# Altium project NixieClockR2.PrjPCB
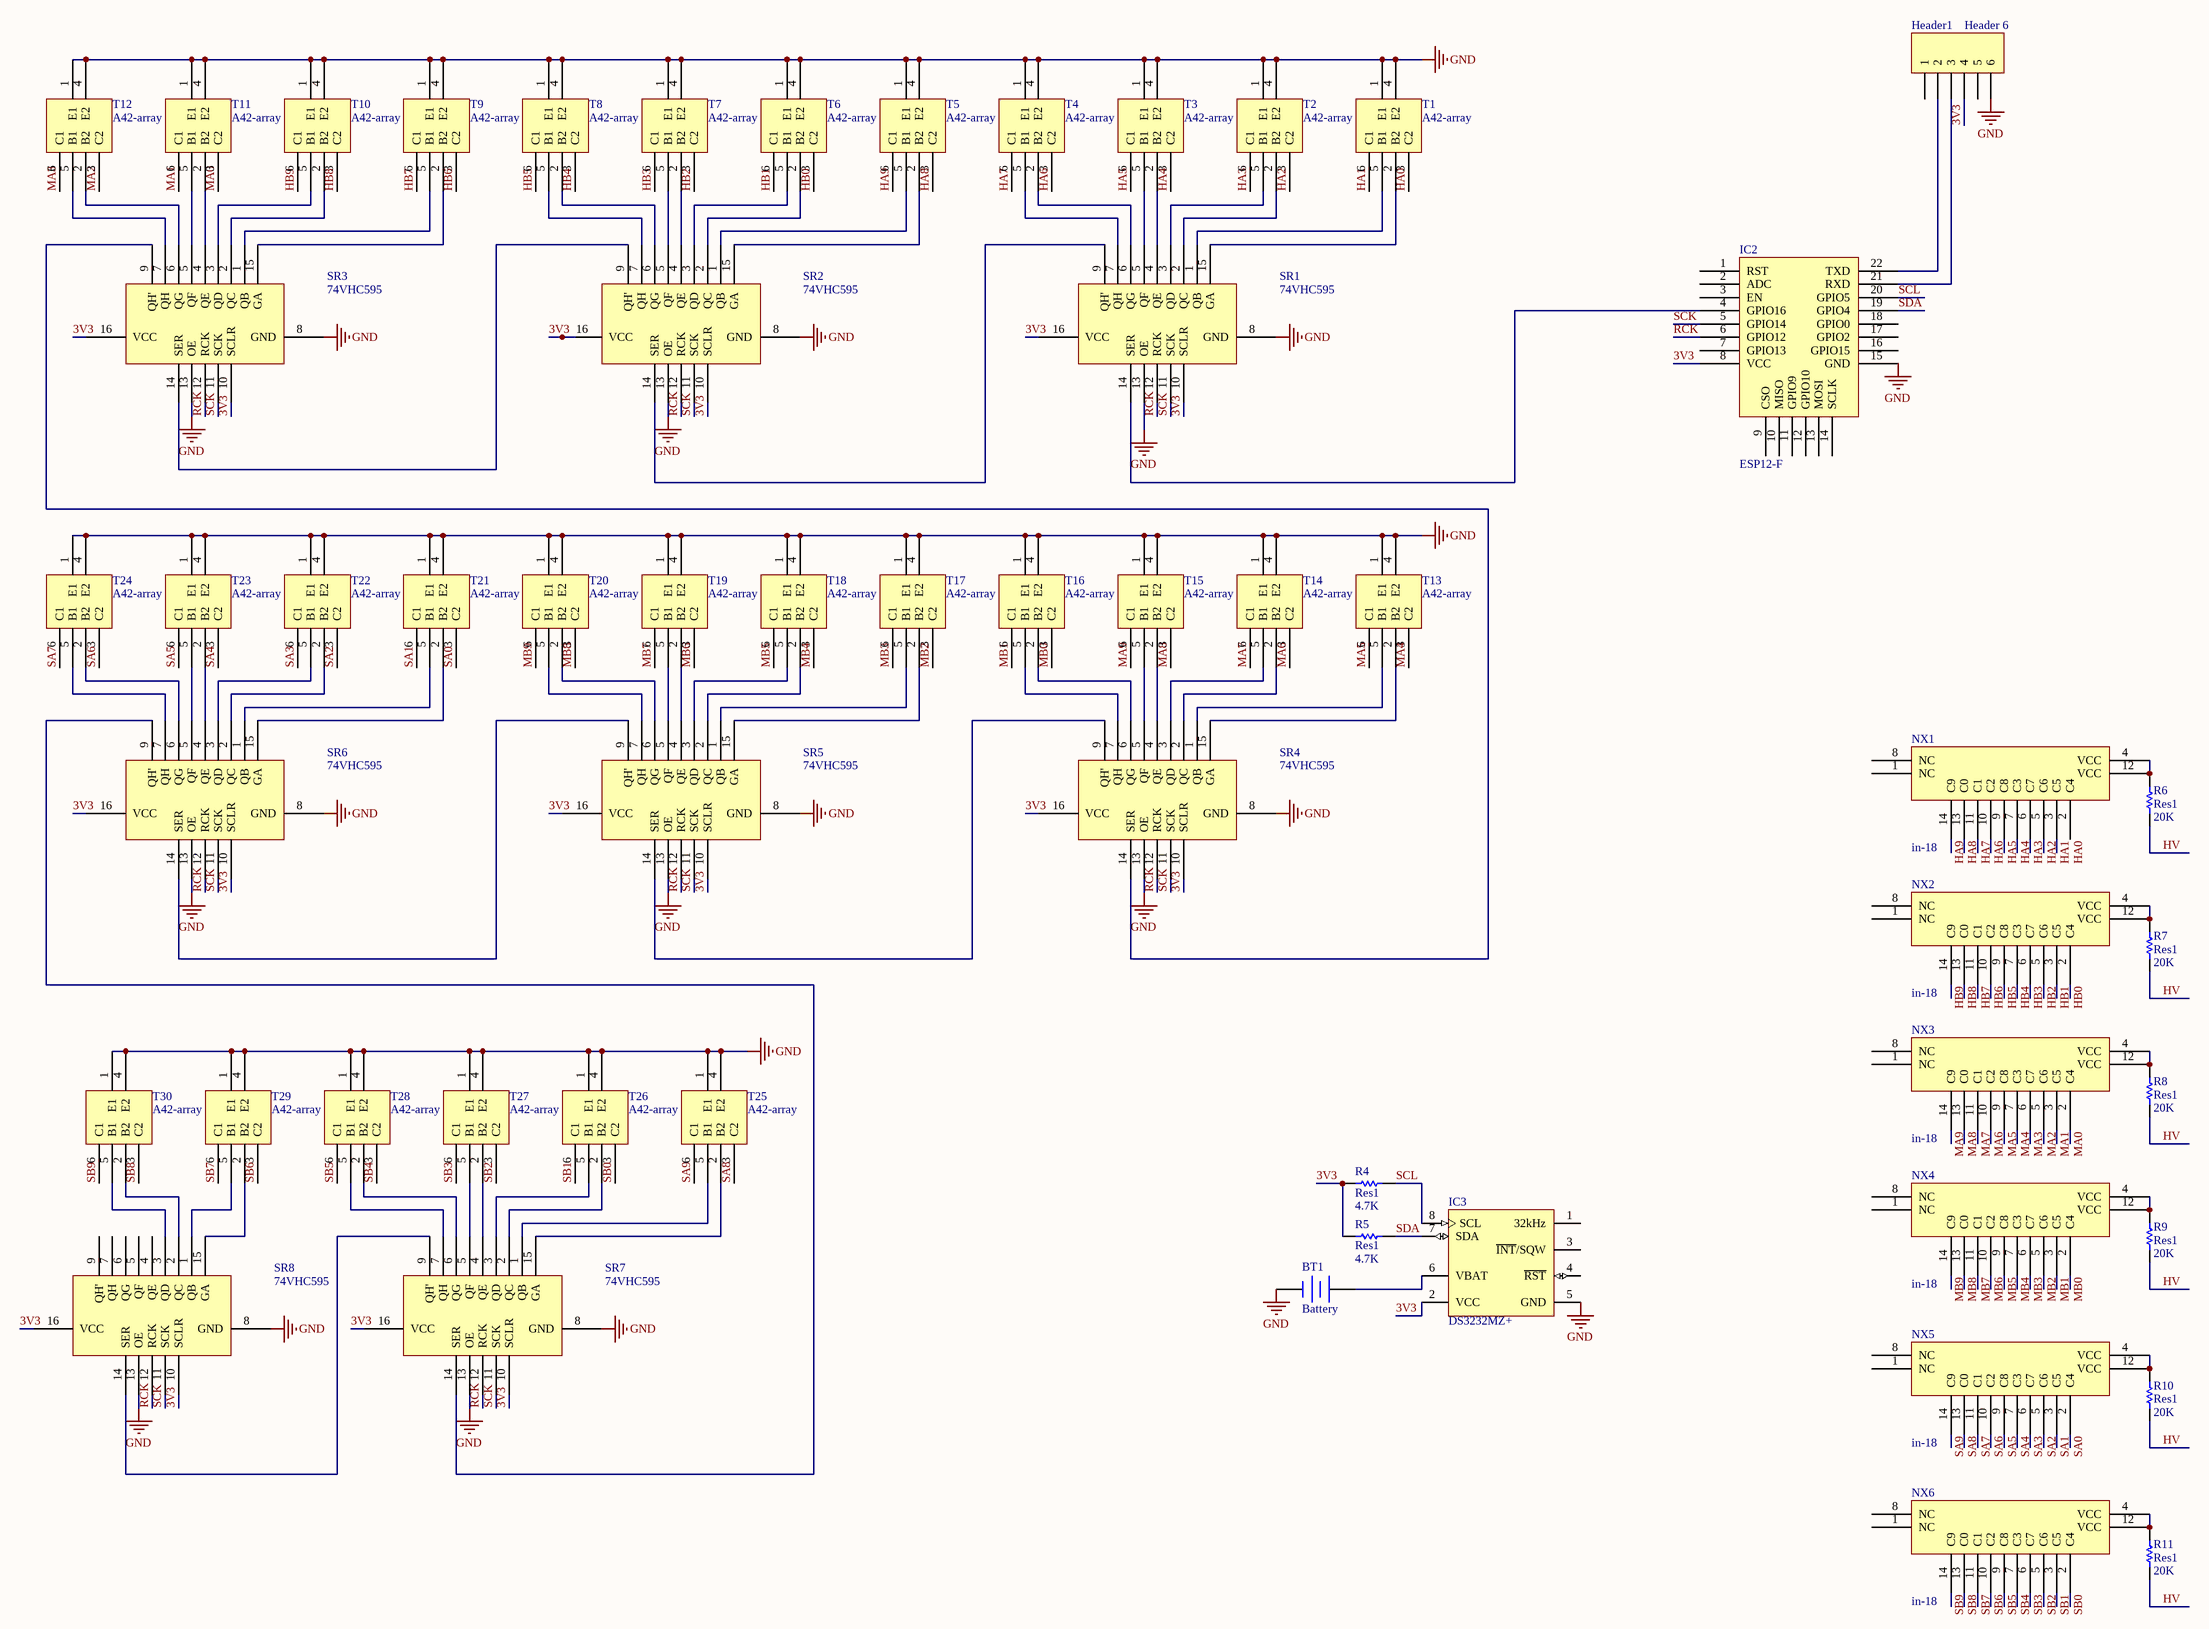
[diagram p0: Digits.SchDoc]
1 sheet, 56 parts. Net scope: global (net labels, ports and power ports of the same name join across sheets).
Board file: NixieClockR2.PcbDoc

## Sheet Digits.SchDoc
size C; Organization: Altium Limited; Address1: L3, 12a Rodborough Rd; Address2: Frenchs Forest; Address3: NSW; Address4: Australia 2086

### Parts
BT1  Battery  [cr1220]
Header1  Header 6  [HDR1X6]
IC2  ESP12-F  [ESP12-F]
IC3  DS3232MZ+  [DS3231]
NX1  in-18  [in-18]
NX2  in-18  [in-18]
NX3  in-18  [in-18]
NX4  in-18  [in-18]
NX5  in-18  [in-18]
NX6  in-18  [in-18]
R4  Res1  value 4.7K  [6-0805_M]
R5  Res1  value 4.7K  [6-0805_M]
R6  Res1  value 20K  [6-0805_M]
R7  Res1  value 20K  [6-0805_M]
R8  Res1  value 20K  [6-0805_M]
R9  Res1  value 20K  [6-0805_M]
R10  Res1  value 20K  [6-0805_M]
R11  Res1  value 20K  [6-0805_M]
SR1  74VHC595  [74VHC595]
SR2  74VHC595  [74VHC595]
SR3  74VHC595  [74VHC595]
SR4  74VHC595  [74VHC595]
SR5  74VHC595  [74VHC595]
SR6  74VHC595  [74VHC595]
SR7  74VHC595  [74VHC595]
SR8  74VHC595  [74VHC595]
T1  A42-array  [SOT457]
T2  A42-array  [SOT457]
T3  A42-array  [SOT457]
T4  A42-array  [SOT457]
T5  A42-array  [SOT457]
T6  A42-array  [SOT457]
T7  A42-array  [SOT457]
T8  A42-array  [SOT457]
T9  A42-array  [SOT457]
T10  A42-array  [SOT457]
T11  A42-array  [SOT457]
T12  A42-array  [SOT457]
T13  A42-array  [SOT457]
T14  A42-array  [SOT457]
T15  A42-array  [SOT457]
T16  A42-array  [SOT457]
T17  A42-array  [SOT457]
T18  A42-array  [SOT457]
T19  A42-array  [SOT457]
T20  A42-array  [SOT457]
T21  A42-array  [SOT457]
T22  A42-array  [SOT457]
T23  A42-array  [SOT457]
T24  A42-array  [SOT457]
T25  A42-array  [SOT457]
T26  A42-array  [SOT457]
T27  A42-array  [SOT457]
T28  A42-array  [SOT457]
T29  A42-array  [SOT457]
T30  A42-array  [SOT457]

### Nets
GND: BT1.2(-) Header1.6 IC2.15(GND) IC3.5(GND) SR1.8(GND) SR1.13(OE) SR2.8(GND) SR2.13(OE) SR3.8(GND) SR3.13(OE) SR4.8(GND) SR4.13(OE) SR5.8(GND) SR5.13(OE) SR6.8(GND) SR6.13(OE) SR7.8(GND) SR7.13(OE) SR8.8(GND) SR8.13(OE) T1.1(E1) T1.4(E2) T2.1(E1) T2.4(E2) T3.1(E1) T3.4(E2) T4.1(E1) T4.4(E2) T5.1(E1) T5.4(E2) T6.1(E1) T6.4(E2) T7.1(E1) T7.4(E2) T8.1(E1) T8.4(E2) T9.1(E1) T9.4(E2) T10.1(E1) T10.4(E2) T11.1(E1) T11.4(E2) T12.1(E1) T12.4(E2) T13.1(E1) T13.4(E2) T14.1(E1) T14.4(E2) T15.1(E1) T15.4(E2) T16.1(E1) T16.4(E2) T17.1(E1) T17.4(E2) T18.1(E1) T18.4(E2) T19.1(E1) T19.4(E2) T20.1(E1) T20.4(E2) T21.1(E1) T21.4(E2) T22.1(E1) T22.4(E2) T23.1(E1) T23.4(E2) T24.1(E1) T24.4(E2) T25.1(E1) T25.4(E2) T26.1(E1) T26.4(E2) T27.1(E1) T27.4(E2) T28.1(E1) T28.4(E2) T29.1(E1) T29.4(E2) T30.1(E1) T30.4(E2)
3V3: Header1.4 IC2.8(VCC) IC3.2(VCC) R4.2 R5.2 SR1.10(SCLR) SR1.16(VCC) SR2.10(SCLR) SR2.16(VCC) SR3.10(SCLR) SR3.16(VCC) SR4.10(SCLR) SR4.16(VCC) SR5.10(SCLR) SR5.16(VCC) SR6.10(SCLR) SR6.16(VCC) SR7.10(SCLR) SR7.16(VCC) SR8.10(SCLR) SR8.16(VCC)
HA0: NX1.2(C4) T1.3(C2)
HA1: NX1.3(C5) T1.6(C1)
HA2: NX1.5(C6) T2.3(C2)
HA3: NX1.6(C7) T2.6(C1)
HA4: NX1.7(C3) T3.3(C2)
HA5: NX1.9(C8) T3.6(C1)
HA6: NX1.10(C2) T4.3(C2)
HA7: NX1.11(C1) T4.6(C1)
HA8: NX1.13(C0) T5.3(C2)
HA9: NX1.14(C9) T5.6(C1)
HB0: NX2.2(C4) T6.3(C2)
HB1: NX2.3(C5) T6.6(C1)
HB2: NX2.5(C6) T7.3(C2)
HB3: NX2.6(C7) T7.6(C1)
HB4: NX2.7(C3) T8.3(C2)
HB5: NX2.9(C8) T8.6(C1)
HB6: NX2.10(C2) T9.3(C2)
HB7: NX2.11(C1) T9.6(C1)
HB8: NX2.13(C0) T10.3(C2)
HB9: NX2.14(C9) T10.6(C1)
HV: R6.1 R7.1 R8.1 R9.1 R10.1 R11.1
MA0: NX3.2(C4) T11.3(C2)
MA1: NX3.3(C5) T11.6(C1)
MA2: NX3.5(C6) T12.3(C2)
MA3: NX3.6(C7) T12.6(C1)
MA4: NX3.7(C3) T13.3(C2)
MA5: NX3.9(C8) T13.6(C1)
MA6: NX3.10(C2) T14.3(C2)
MA7: NX3.11(C1) T14.6(C1)
MA8: NX3.13(C0) T15.3(C2)
MA9: NX3.14(C9) T15.6(C1)
MB0: NX4.2(C4) T16.3(C2)
MB1: NX4.3(C5) T16.6(C1)
MB2: NX4.5(C6) T17.3(C2)
MB3: NX4.6(C7) T17.6(C1)
MB4: NX4.7(C3) T18.3(C2)
MB5: NX4.9(C8) T18.6(C1)
MB6: NX4.10(C2) T19.3(C2)
MB7: NX4.11(C1) T19.6(C1)
MB8: NX4.13(C0) T20.3(C2)
MB9: NX4.14(C9) T20.6(C1)
RCK: IC2.6(GPIO12) SR1.12(RCK) SR2.12(RCK) SR3.12(RCK) SR4.12(RCK) SR5.12(RCK) SR6.12(RCK) SR7.12(RCK) SR8.12(RCK)
SA0: NX5.2(C4) T21.3(C2)
SA1: NX5.3(C5) T21.6(C1)
SA2: NX5.5(C6) T22.3(C2)
SA3: NX5.6(C7) T22.6(C1)
SA4: NX5.7(C3) T23.3(C2)
SA5: NX5.9(C8) T23.6(C1)
SA6: NX5.10(C2) T24.3(C2)
SA7: NX5.11(C1) T24.6(C1)
SA8: NX5.13(C0) T25.3(C2)
SA9: NX5.14(C9) T25.6(C1)
SB0: NX6.2(C4) T26.3(C2)
SB1: NX6.3(C5) T26.6(C1)
SB2: NX6.5(C6) T27.3(C2)
SB3: NX6.6(C7) T27.6(C1)
SB4: NX6.7(C3) T28.3(C2)
SB5: NX6.9(C8) T28.6(C1)
SB6: NX6.10(C2) T29.3(C2)
SB7: NX6.11(C1) T29.6(C1)
SB8: NX6.13(C0) T30.3(C2)
SB9: NX6.14(C9) T30.6(C1)
SCK: IC2.5(GPIO14) SR1.11(SCK) SR2.11(SCK) SR3.11(SCK) SR4.11(SCK) SR5.11(SCK) SR6.11(SCK) SR7.11(SCK) SR8.11(SCK)
SCL: IC2.20(GPIO5) IC3.8(SCL) R4.1
SDA: IC2.19(GPIO4) IC3.7(SDA) R5.1
NetBT1_1: BT1.1(+) IC3.6(VBAT)
NetHeader1_2: Header1.2 IC2.22(TXD)
NetHeader1_3: Header1.3 IC2.21(RXD)
NetIC2_4: IC2.4(GPIO16) SR1.14(SER)
NetNX1_4: NX1.4(VCC) NX1.12(VCC) R6.2
NetNX2_4: NX2.4(VCC) NX2.12(VCC) R7.2
NetNX3_4: NX3.4(VCC) NX3.12(VCC) R8.2
NetNX4_4: NX4.4(VCC) NX4.12(VCC) R9.2
NetNX5_4: NX5.4(VCC) NX5.12(VCC) R10.2
NetNX6_4: NX6.4(VCC) NX6.12(VCC) R11.2
NetSR1_1: SR1.1(QB) T1.5(B1)
NetSR1_2: SR1.2(QC) T2.2(B2)
NetSR1_3: SR1.3(QD) T2.5(B1)
NetSR1_4: SR1.4(QE) T3.2(B2)
NetSR1_5: SR1.5(QF) T3.5(B1)
NetSR1_6: SR1.6(QG) T4.2(B2)
NetSR1_7: SR1.7(QH) T4.5(B1)
NetSR1_9: SR1.9(QH') SR2.14(SER)
NetSR1_15: SR1.15(GA) T1.2(B2)
NetSR2_1: SR2.1(QB) T5.5(B1)
NetSR2_2: SR2.2(QC) T6.2(B2)
NetSR2_3: SR2.3(QD) T6.5(B1)
NetSR2_4: SR2.4(QE) T7.2(B2)
NetSR2_5: SR2.5(QF) T7.5(B1)
NetSR2_6: SR2.6(QG) T8.2(B2)
NetSR2_7: SR2.7(QH) T8.5(B1)
NetSR2_9: SR2.9(QH') SR3.14(SER)
NetSR2_15: SR2.15(GA) T5.2(B2)
NetSR3_1: SR3.1(QB) T9.5(B1)
NetSR3_2: SR3.2(QC) T10.2(B2)
NetSR3_3: SR3.3(QD) T10.5(B1)
NetSR3_4: SR3.4(QE) T11.2(B2)
NetSR3_5: SR3.5(QF) T11.5(B1)
NetSR3_6: SR3.6(QG) T12.2(B2)
NetSR3_7: SR3.7(QH) T12.5(B1)
NetSR3_9: SR3.9(QH') SR4.14(SER)
NetSR3_15: SR3.15(GA) T9.2(B2)
NetSR4_1: SR4.1(QB) T13.5(B1)
NetSR4_2: SR4.2(QC) T14.2(B2)
NetSR4_3: SR4.3(QD) T14.5(B1)
NetSR4_4: SR4.4(QE) T15.2(B2)
NetSR4_5: SR4.5(QF) T15.5(B1)
NetSR4_6: SR4.6(QG) T16.2(B2)
NetSR4_7: SR4.7(QH) T16.5(B1)
NetSR4_9: SR4.9(QH') SR5.14(SER)
NetSR4_15: SR4.15(GA) T13.2(B2)
NetSR5_1: SR5.1(QB) T17.5(B1)
NetSR5_2: SR5.2(QC) T18.2(B2)
NetSR5_3: SR5.3(QD) T18.5(B1)
NetSR5_4: SR5.4(QE) T19.2(B2)
NetSR5_5: SR5.5(QF) T19.5(B1)
NetSR5_6: SR5.6(QG) T20.2(B2)
NetSR5_7: SR5.7(QH) T20.5(B1)
NetSR5_9: SR5.9(QH') SR6.14(SER)
NetSR5_15: SR5.15(GA) T17.2(B2)
NetSR6_1: SR6.1(QB) T21.5(B1)
NetSR6_2: SR6.2(QC) T22.2(B2)
NetSR6_3: SR6.3(QD) T22.5(B1)
NetSR6_4: SR6.4(QE) T23.2(B2)
NetSR6_5: SR6.5(QF) T23.5(B1)
NetSR6_6: SR6.6(QG) T24.2(B2)
NetSR6_7: SR6.7(QH) T24.5(B1)
NetSR6_9: SR6.9(QH') SR7.14(SER)
NetSR6_15: SR6.15(GA) T21.2(B2)
NetSR7_1: SR7.1(QB) T25.5(B1)
NetSR7_2: SR7.2(QC) T26.2(B2)
NetSR7_3: SR7.3(QD) T26.5(B1)
NetSR7_4: SR7.4(QE) T27.2(B2)
NetSR7_5: SR7.5(QF) T27.5(B1)
NetSR7_6: SR7.6(QG) T28.2(B2)
NetSR7_7: SR7.7(QH) T28.5(B1)
NetSR7_9: SR7.9(QH') SR8.14(SER)
NetSR7_15: SR7.15(GA) T25.2(B2)
NetSR8_1: SR8.1(QB) T29.5(B1)
NetSR8_2: SR8.2(QC) T30.2(B2)
NetSR8_3: SR8.3(QD) T30.5(B1)
NetSR8_15: SR8.15(GA) T29.2(B2)

Not connected (* = marked no-connect by the designer): Header1 1 5; IC2 1(RST) 2(ADC) 3(EN) 7(GPIO13) 9(CSO) 10(MISO) 11(GPIO9) 12(GPIO10) 13(MOSI) 14(SCLK) 16(GPIO15) 17(GPIO2) 18(GPIO0); IC3 1(32kHz) 3(~{INT}/SQW) 4(~{RST}); NX1 1(NC) 8(NC); NX2 1(NC) 8(NC); NX3 1(NC) 8(NC); NX4 1(NC) 8(NC); NX5 1(NC) 8(NC); NX6 1(NC) 8(NC); SR8 4(QE) 5(QF) 6(QG) 7(QH) 9(QH')

### Notes on the sheet
- Title
- Size:
- Date:
- File:
- C
- Number:
- Time:
- Revision:
- Sheet
- of

### Library data of the parts
BT1 = Battery: Multicell Battery; Published: 24-Mar-1999; LatestRevisionDate: 17-Jul-2002; LatestRevisionNote: Re-released for DXP Platform.; PackageReference: BAT-2; Publisher: Altium Limited; PackageDescription: Battery; 2 Leads
Header1 = Header 6: Header, 6-Pin; LatestRevisionDate: 17-Jul-2002; LatestRevisionNote: Re-released for DXP Platform.; Publisher: Altium Limited
IC3 = DS3232MZ+: +/-5ppm, I2C Real-Time Clock with Internal MEMs Resonator and SRAM, 8-Pin SO, -40 to 85 degC, Pb-Free; DatasheetVersion: Rev 0, Mar-2012; PackageVersion: revC, 2010; PackageReference: S8MK+1; PackageDescription: 8-Pin Small-Outline IC, Narrow (0.15in), 1.27 mm Pitch, SOIC (N), Pb-Free; Code_JEDEC: MS-012-AA; Code_IPC: SOIC127P600-8; ComponentLink1Description: Manufacturer URL; ComponentLink1URL: http://www.maxim-ic.com; ComponentLink2Description: Datasheet; ComponentLink2URL: http://datasheets.maxim-ic.com/en/ds/DS3232M.pdf; ComponentLink3Description: Package Specification; ComponentLink3URL: http://pdfserv.maxim-ic.com/package_dwgs/21-0041.PDF
R4-R11 = Res1: Resistor; Published: 8-Jun-2000; LatestRevisionDate: 17-Jul-2002; LatestRevisionNote: Re-released for DXP Platform.; PackageReference: AXIAL-0.3; Publisher: Altium Limited; PackageDescription: Axial Device, Thru-Hole; 2 Leads; 0.3 in Pin Spacing